# Altium project PW-Sat2_EPS_EM_MPPT-Buck-Boost-Conv.PrjPcb
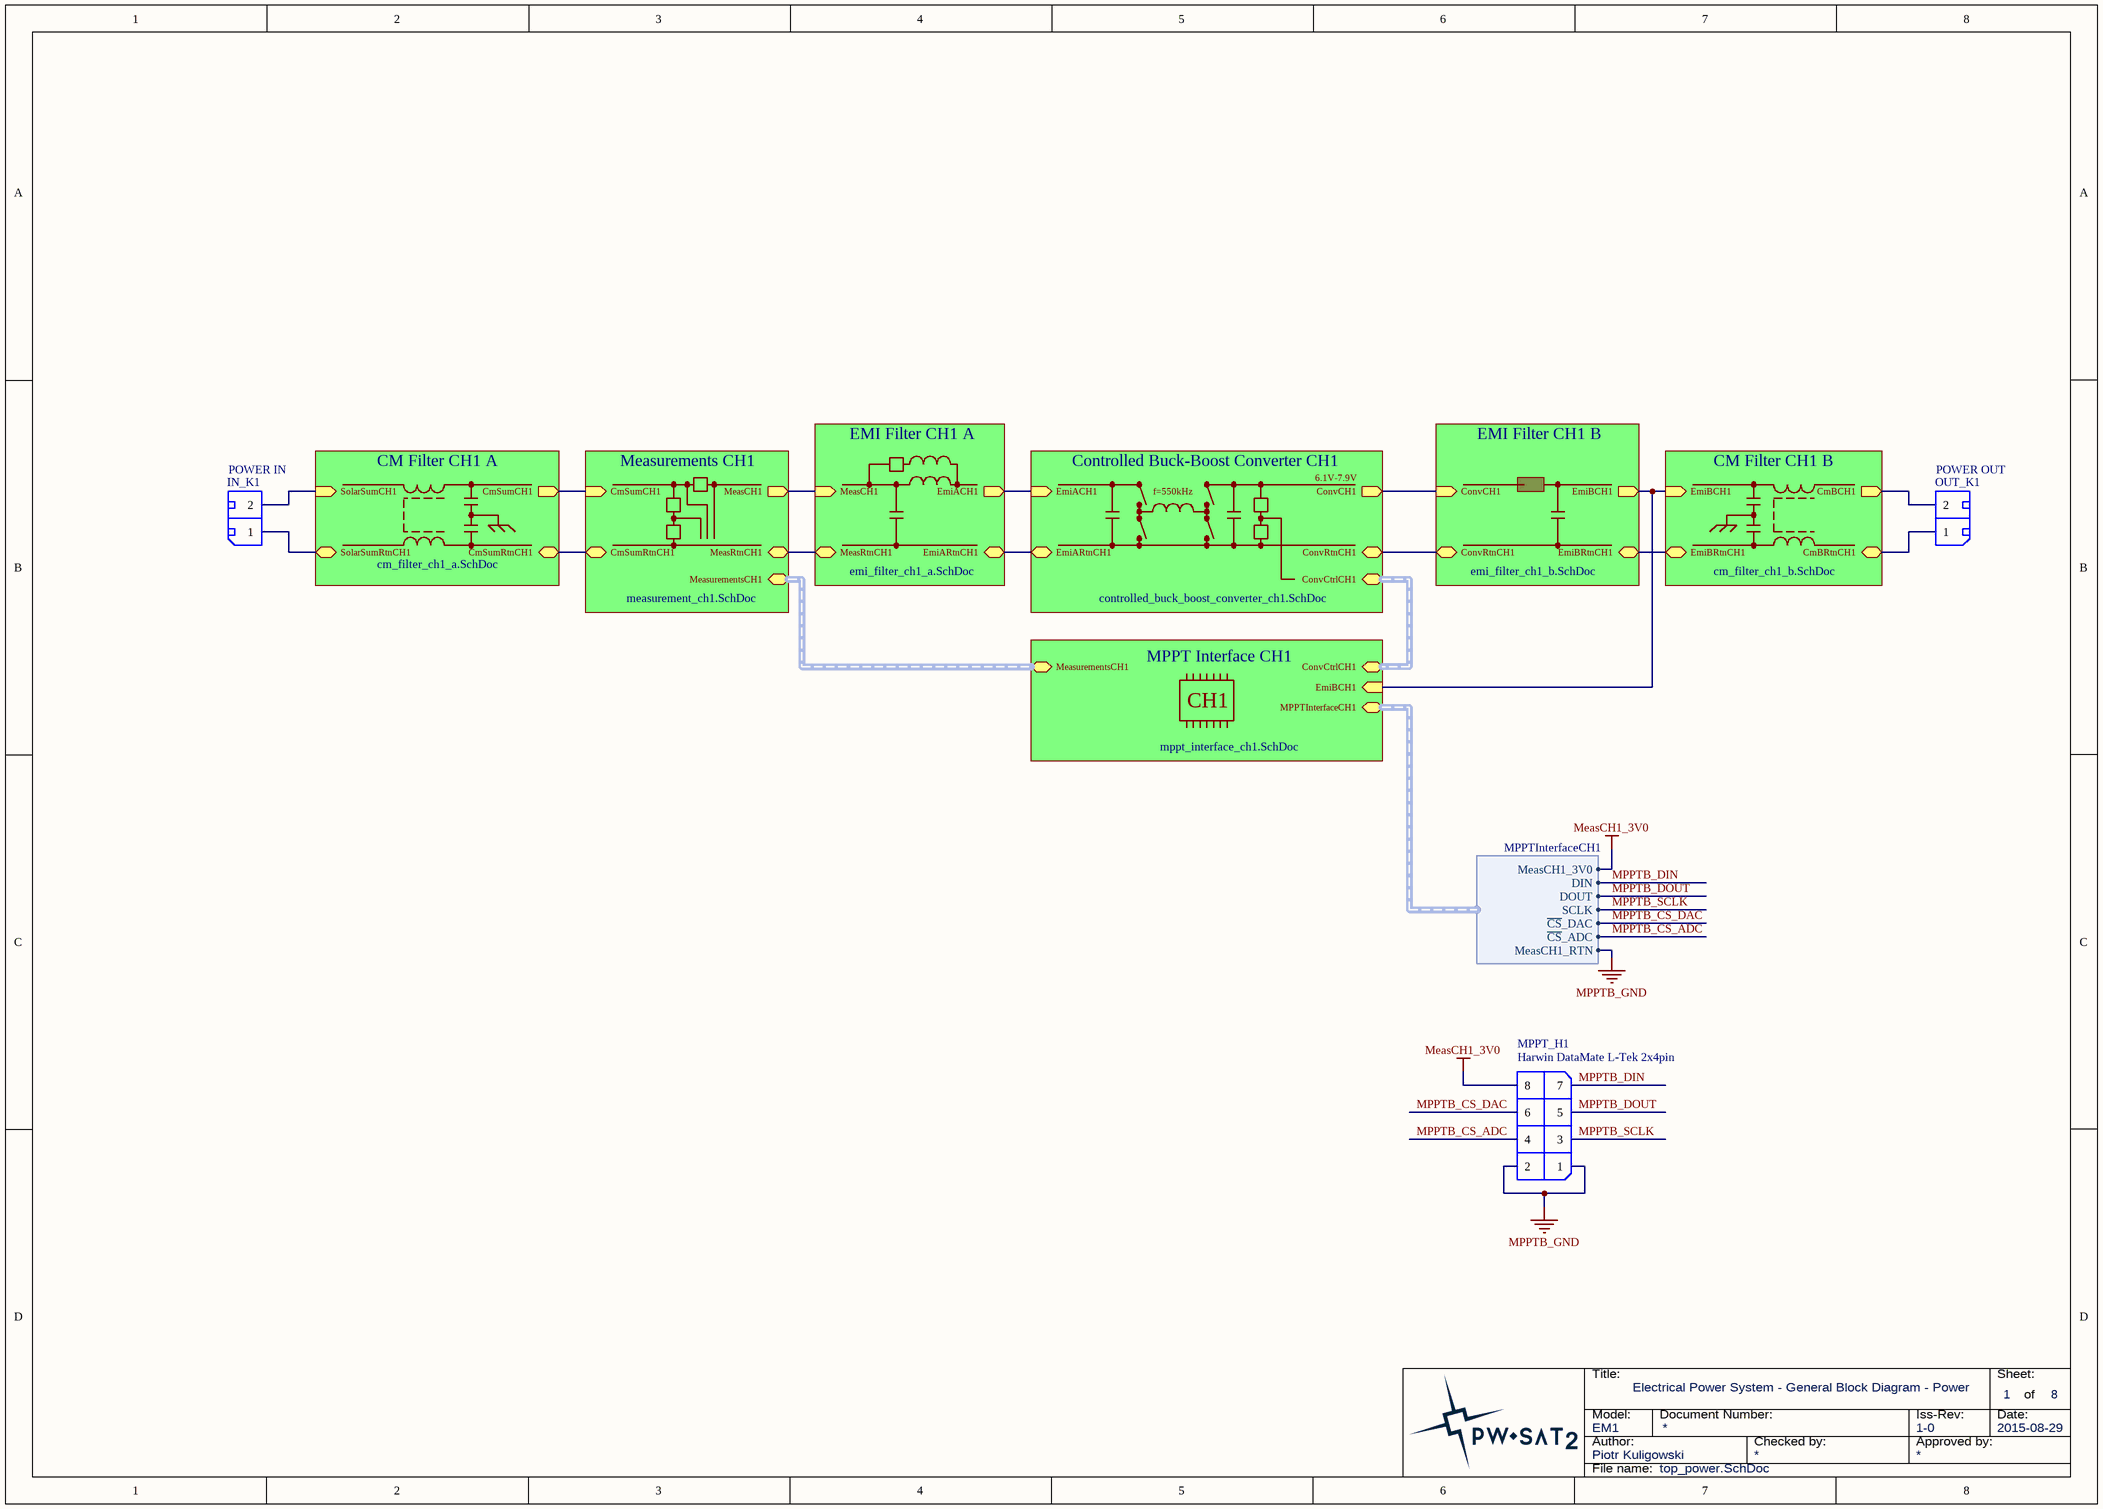
[diagram p0: top_power.SchDoc]
8 sheets, 80 parts. Net scope: hierarchical (ports join the sheet entries above them; power ports are global).
Sheets:
  top_power.SchDoc
    CM Filter CH1 A = cm_filter_ch1_a.SchDoc
    MPPT Interface CH1 = mppt_interface_ch1.SchDoc
    Measurements CH1 = measurement_ch1.SchDoc
    EMI Filter CH1 A = emi_filter_ch1_a.SchDoc
    EMI Filter CH1 B = emi_filter_ch1_b.SchDoc
    CM Filter CH1 B = cm_filter_ch1_b.SchDoc
    Controlled Buck-Boost Converter CH1 = controlled_buck_boost_converter_ch1.SchDoc

## Sheet top_power.SchDoc: Electrical Power System - General Block Diagram - Power
size A3; Date: 2015-08-29; Author: Piotr Kuligowski; Revision: 1-0; SheetNumber: 1; SheetTotal: 8; Model: EM1; PageSetup: Record=PageOptions|CenterHorizontal=True|CenterVertical=True|PrintScale=0.52|XCorrection=1.00|YCorrection=1.00|PrintKind=1|BorderSize=5000000|LeftOffset=0|BottomOffset=0|Orientation=2|PaperLength=4200|PaperWidth=2970|Scale=100|PaperSource=7|PrintQuality=600|MediaType=1|DitherType=10|PaperKind=A3|PrintScaleMode=1

### Parts
IN_K1  ProviderPartNumber: POWER IN  [TerminalBlock_Spring_2.54_2-R]  (hidden comment: TB-2.5-PD-xx)
MPPT_H1  Harwin DataMate L-Tek 2x4pin  [Harwin_Datamate_L-Tek_M80-8670805]
OUT_K1  ProviderPartNumber: POWER OUT  [TerminalBlock_Spring_2.54_2-R]  (hidden comment: TB-2.5-PD-xx)

### Sub-sheets
CM Filter CH1 A = cm_filter_ch1_a.SchDoc: CmSumCH1 (out), SolarSumCH1 (in), SolarSumRtnCH1, CmSumRtnCH1
CM Filter CH1 B = cm_filter_ch1_b.SchDoc: CmBCH1 (out), EmiBCH1 (in), EmiBRtnCH1, CmBRtnCH1
Controlled Buck-Boost Converter CH1 = controlled_buck_boost_converter_ch1.SchDoc: ConvCH1 (out), ConvRtnCH1, EmiACH1 (in), EmiARtnCH1, ConvCtrlCH1 (harness ConvCtrlCH1)
EMI Filter CH1 A = emi_filter_ch1_a.SchDoc: EmiACH1 (out), MeasCH1 (in), MeasRtnCH1, EmiARtnCH1
EMI Filter CH1 B = emi_filter_ch1_b.SchDoc: EmiBCH1 (out), ConvCH1 (in), ConvRtnCH1, EmiBRtnCH1
Measurements CH1 = measurement_ch1.SchDoc: MeasCH1 (out), CmSumCH1 (in), MeasRtnCH1, CmSumRtnCH1, MeasurementsCH1 (harness MeasurementsCH1)
MPPT Interface CH1 = mppt_interface_ch1.SchDoc: MPPTInterfaceCH1 (harness MPPTInterfaceCH1), EmiBCH1 (in), MeasurementsCH1 (harness MeasurementsCH1), ConvCtrlCH1 (harness ConvCtrlCH1)

### Harnesses
MPPTInterfaceCH1: DIN, DOUT, SCLK, ~{CS}_DAC, ~{CS}_ADC, MeasCH1_3V0, MeasCH1_RTN

### Nets
MeasCH1_3V0: MPPT_H1.8 ; sheet MPPT Interface CH1/MPPTInterfaceCH1.MeasCH1_3V0
MPPTB_GND: MPPT_H1.1 MPPT_H1.2 ; sheet CM Filter CH1 A/CmSumRtnCH1, sheet Measurements CH1/MeasRtnCH1, sheet Measurements CH1/CmSumRtnCH1, sheet EMI Filter CH1 A/MeasRtnCH1, sheet EMI Filter CH1 A/EmiARtnCH1, sheet EMI Filter CH1 B/ConvRtnCH1, sheet EMI Filter CH1 B/EmiBRtnCH1, sheet CM Filter CH1 B/EmiBRtnCH1, sheet Controlled Buck-Boost Converter CH1/ConvRtnCH1, sheet Controlled Buck-Boost Converter CH1/EmiARtnCH1, sheet MPPT Interface CH1/MPPTInterfaceCH1.MeasCH1_RTN  [project net DCDCB_GND]
MPPTB_CS_ADC: MPPT_H1.4 ; sheet MPPT Interface CH1/MPPTInterfaceCH1.~{CS}_ADC
MPPTB_CS_DAC: MPPT_H1.6 ; sheet MPPT Interface CH1/MPPTInterfaceCH1.~{CS}_DAC
MPPTB_DIN: MPPT_H1.7 ; sheet MPPT Interface CH1/MPPTInterfaceCH1.DIN
MPPTB_DOUT: MPPT_H1.5 ; sheet MPPT Interface CH1/MPPTInterfaceCH1.DOUT
MPPTB_SCLK: MPPT_H1.3 ; sheet MPPT Interface CH1/MPPTInterfaceCH1.SCLK
NetCMBA_C1_1: sheet CM Filter CH1 A/CmSumCH1, sheet Measurements CH1/CmSumCH1
NetCMBA_T1_1: IN_K1.2 ; sheet CM Filter CH1 A/SolarSumCH1
NetCMBA_T1_2: IN_K1.1 ; sheet CM Filter CH1 A/SolarSumRtnCH1
NetCMBB_C1_1: sheet MPPT Interface CH1/EmiBCH1, sheet EMI Filter CH1 B/EmiBCH1, sheet CM Filter CH1 B/EmiBCH1
NetCMBB_T1_3: OUT_K1.1 ; sheet CM Filter CH1 B/CmBRtnCH1
NetCMBB_T1_4: OUT_K1.2 ; sheet CM Filter CH1 B/CmBCH1
NetDCDCB_C3_2: sheet EMI Filter CH1 A/EmiACH1, sheet Controlled Buck-Boost Converter CH1/EmiACH1
NetDCDCB_C4_2: sheet EMI Filter CH1 B/ConvCH1, sheet Controlled Buck-Boost Converter CH1/ConvCH1
NetEMIBA_C1_1: sheet Measurements CH1/MeasCH1, sheet EMI Filter CH1 A/MeasCH1

### Buses and harness runs
harness sheet Controlled Buck-Boost Converter CH1/ConvCtrlCH1 = sheet MPPT Interface CH1/ConvCtrlCH1
harness sheet Measurements CH1/MeasurementsCH1 = sheet MPPT Interface CH1/MeasurementsCH1

### Notes on the sheet
- f=550kHz
- 6.1V-7.9V
- CH1
- Title:
- Sheet:
- of
- Author:
- Model:
- Document Number:
- Checked by:
- Iss-Rev:
- Approved by:
- Date:
- File name:

### Library data of the parts
IN_K1 OUT_K1 = TerminalBlock_Spring_2.54_2-R: Terminal block with spring, 2-pin, 2.54mm pitch, right angle.; Provider: TME.eu; Value: TB-2.5-PD-xx
MPPT_H1 = Harwin_Datamate_L-Tek_2x4pin: Harwin DataMate L-Tek, 2mm pitch, 2x4pin.; Value: Harwin DataMate L-Tek 2x4pin

## Sheet cm_filter_ch1_a.SchDoc: Common Mode Filter CH1 A
size A4; Date: 2015-02-21; Author: Piotr Kuligowski; Revision: 1-0; SheetTotal: 14; Model: EM1
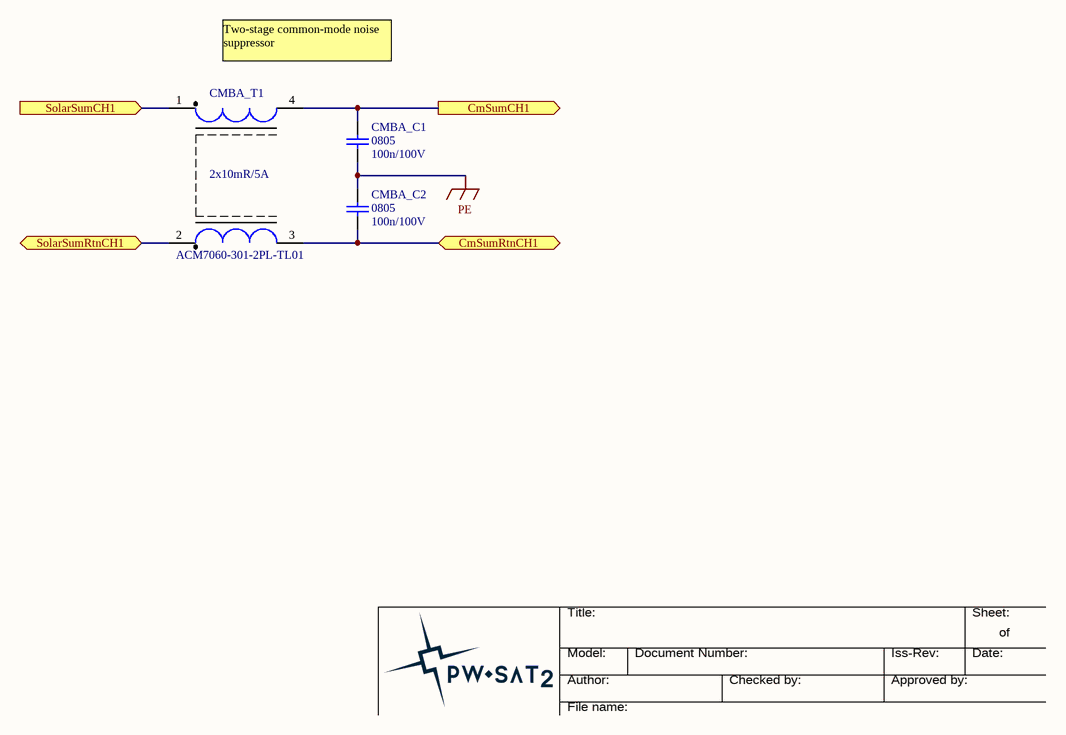
[diagram p1: cm_filter_ch1_a.SchDoc]

### Parts
CMBA_C1  Package: 0805  [SMD_Capacitor_0805]  (hidden comment: 100n/100V)
CMBA_C2  Package: 0805  [SMD_Capacitor_0805]  (hidden comment: 100n/100V)
CMBA_T1  2x10mR/5A  [TDK_ACM7060]

### Ports
CmSumCH1 (out), CmSumRtnCH1, SolarSumCH1 (in), SolarSumRtnCH1

### Nets
DCDCB_GND: CMBA_C2.2 CMBA_T1.3 ; port CmSumRtnCH1
PE: CMBA_C1.2 CMBA_C2.1
NetCMBA_C1_1: CMBA_C1.1 CMBA_T1.4 ; port CmSumCH1
NetCMBA_T1_1: CMBA_T1.1 ; port SolarSumCH1
NetCMBA_T1_2: CMBA_T1.2 ; port SolarSumRtnCH1

### Notes on the sheet
- Two-stage common-mode noise suppressor
- Title:
- Sheet:
- of
- Author:
- Model:
- Document Number:
- Checked by:
- Iss-Rev:
- Approved by:
- Date:
- File name:

### Library data of the parts
CMBA_C1 CMBA_C2 = Cer_C0805T104K1RCLTU: Ceramic Cap Kemet COTS 100n/100V X7R 0805; ManufacturerPartNumber: C0805T104K1RCLTU; Manufacturer: Kemet; Value: 100n/100V
CMBA_T1 = ACM7060-301-2PL-TL01: TDK ACM7060-301 Common Mode Choke; Manufacturer: TDK; ManufacturerPartNumber: ACM7060-301-2PL-TL01; Value: 2x10mR/5A

## Sheet mppt_interface_ch1.SchDoc: MPPT Interface CH1
size A3; Date: 2015-10-14; Author: Piotr Kuligowski; Revision: 1-0; SheetNumber: 8; SheetTotal: 8; Model: EM1
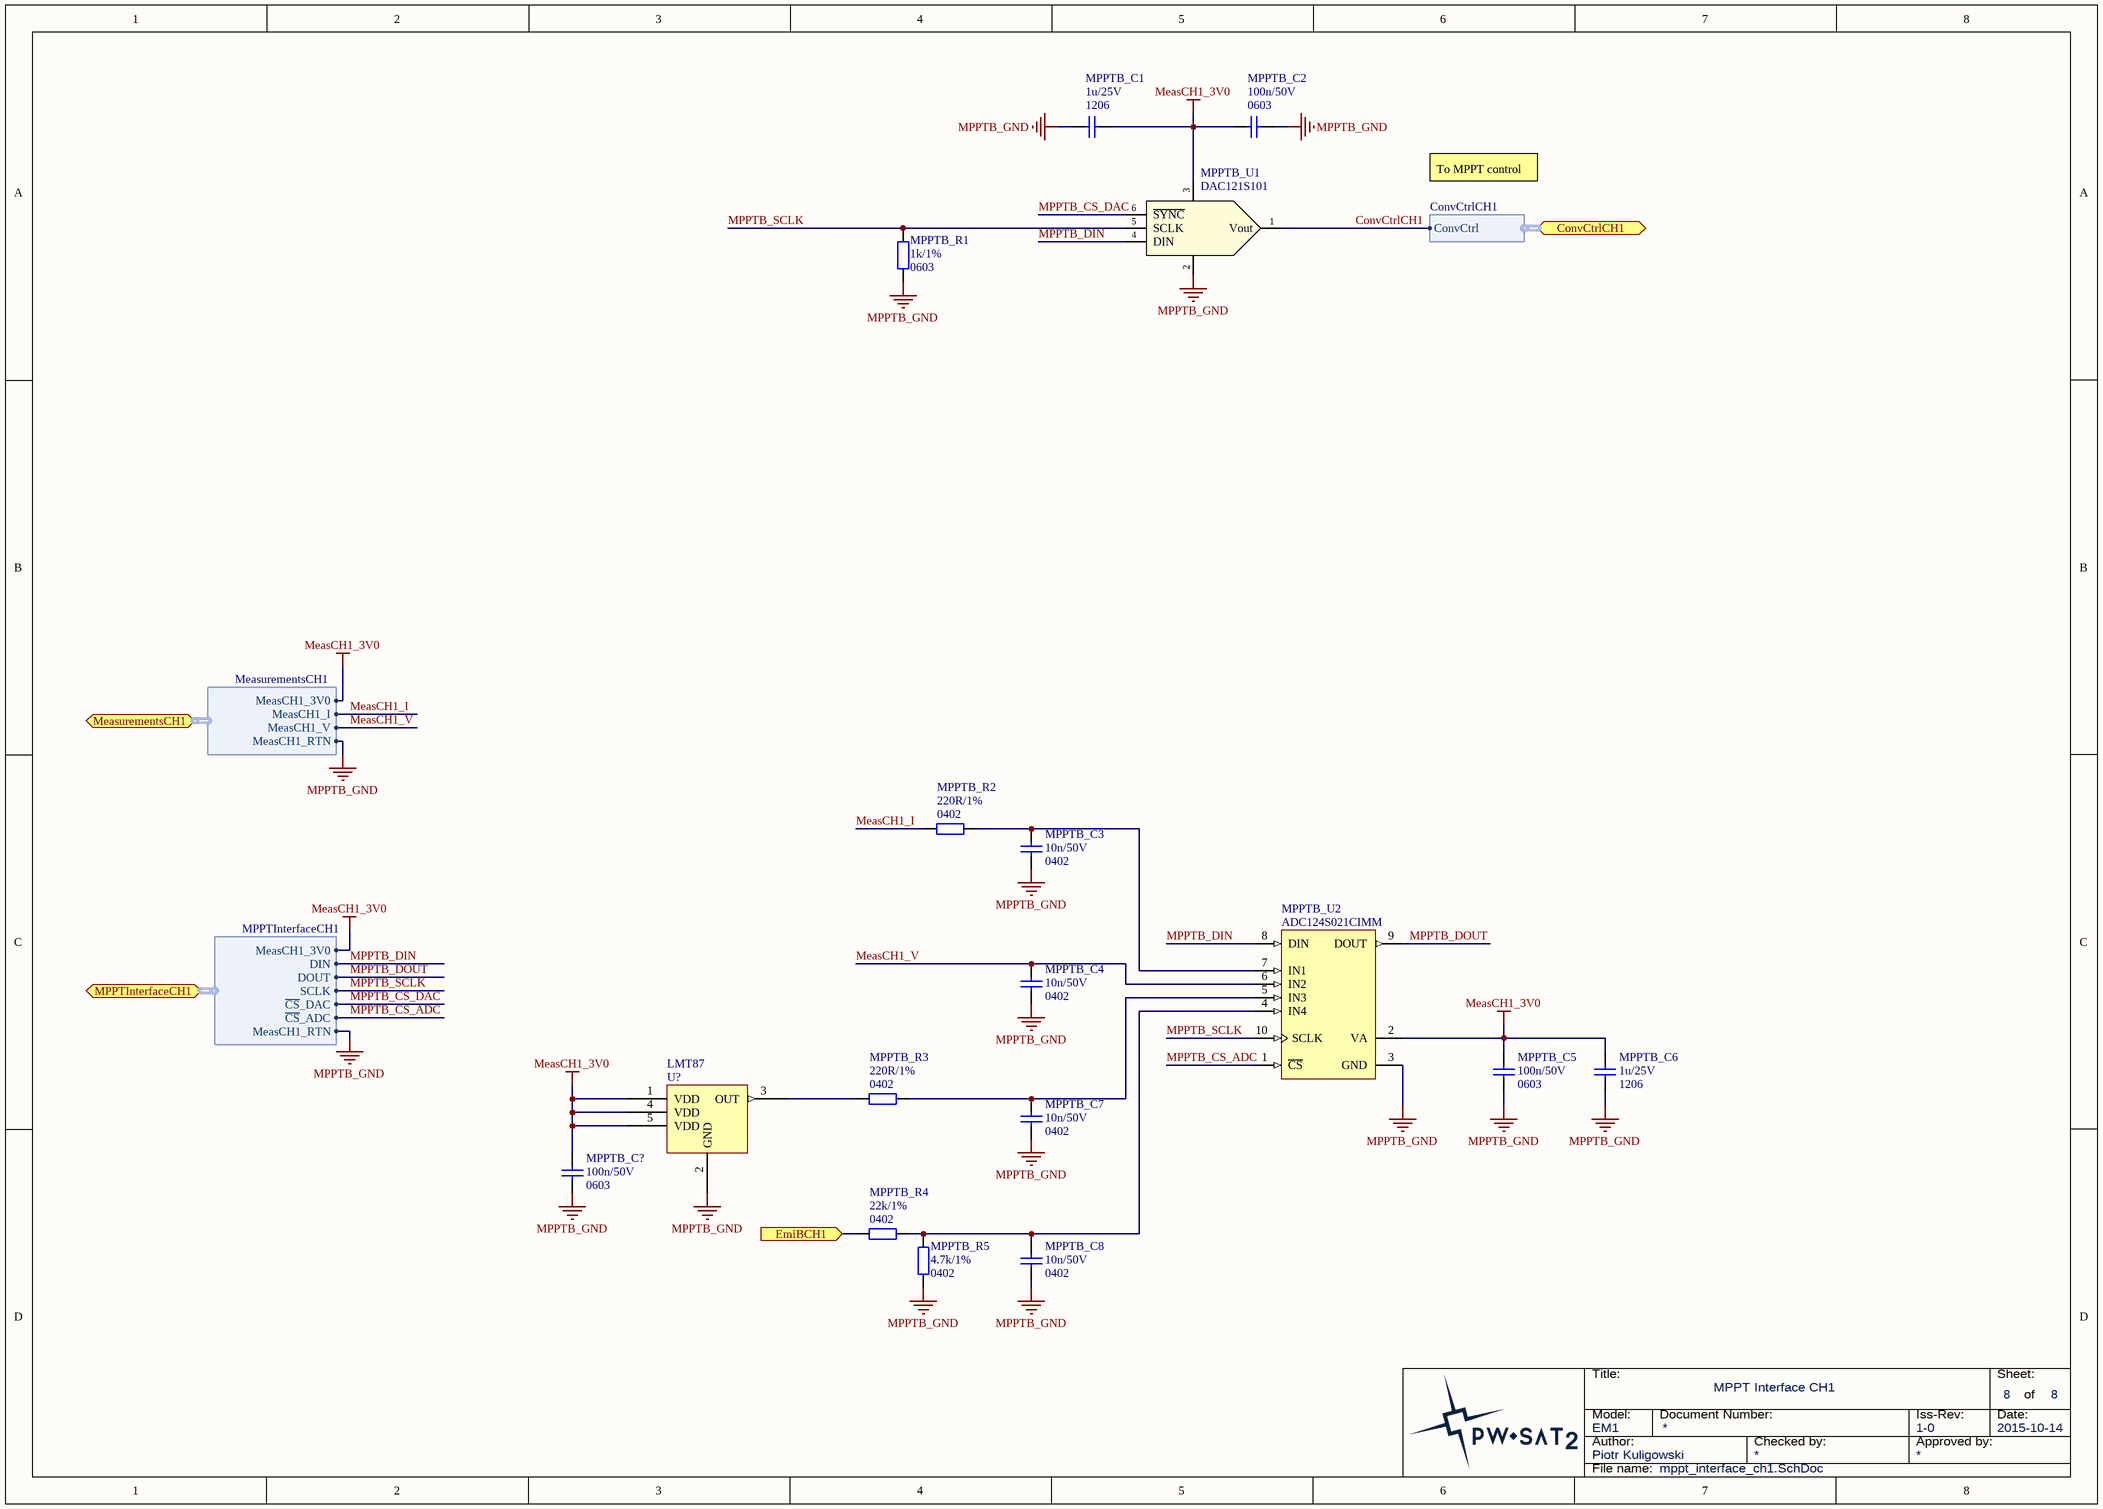
[diagram p2: mppt_interface_ch1.SchDoc]

### Parts
MPPTB_C1  Package: 1206  [SMD_Capacitor_1206]  (hidden comment: 1u/25V)
MPPTB_C2  Package: 0603  [SMD_Capacitor_0603]  (hidden comment: 100n/50V)
MPPTB_C3  Package: 0402  [SMD_Capacitor_0402]  (hidden comment: 10n/50V)
MPPTB_C4  Package: 0402  [SMD_Capacitor_0402]  (hidden comment: 10n/50V)
MPPTB_C5  Package: 0603  [SMD_Capacitor_0603]  (hidden comment: 100n/50V)
MPPTB_C6  Package: 1206  [SMD_Capacitor_1206]  (hidden comment: 1u/25V)
MPPTB_C7  Package: 0402  [SMD_Capacitor_0402]  (hidden comment: 10n/50V)
MPPTB_C8  Package: 0402  [SMD_Capacitor_0402]  (hidden comment: 10n/50V)
MPPTB_C?  Package: 0603  [SMD_Capacitor_0603]  (hidden comment: 100n/50V)
MPPTB_R1  Package: 0603  [SMD_Resistor_0603]  (hidden comment: 1k/1%)
MPPTB_R2  Package: 0402  [SMD_Resistor_0402]  (hidden comment: 220R/1%)
MPPTB_R3  Package: 0402  [SMD_Resistor_0402]  (hidden comment: 220R/1%)
MPPTB_R4  Package: 0402  [SMD_Resistor_0402]  (hidden comment: 22k/1%)
MPPTB_R5  Package: 0402  [SMD_Resistor_0402]  (hidden comment: 4.7k/1%)
MPPTB_U1  DAC121S101  [SOT23-6]
MPPTB_U2  ADC124S021CIMM  [MUB10A_L]
U?  LMT87  [SC70-LT5_N]

### Ports
ConvCtrlCH1 (harness ConvCtrlCH1), EmiBCH1 (in), MeasurementsCH1 (harness MeasurementsCH1), MPPTInterfaceCH1 (harness MPPTInterfaceCH1)

### Harnesses
MeasurementsCH1: MeasCH1_RTN, MeasCH1_V, MeasCH1_I, MeasCH1_3V0
ConvCtrlCH1: ConvCtrl
MPPTInterfaceCH1: DIN, DOUT, SCLK, ~{CS}_DAC, ~{CS}_ADC, MeasCH1_3V0, MeasCH1_RTN

### Nets
MeasCH1_3V0: MPPTB_C1.2 MPPTB_C2.2 MPPTB_C5.1 MPPTB_C6.1 MPPTB_C?.1 MPPTB_U1.3(Va) MPPTB_U2.2(VA) U?.1(VDD) U?.4(VDD) U?.5(VDD) ; port MeasurementsCH1.MeasCH1_3V0, port MPPTInterfaceCH1.MeasCH1_3V0
MPPTB_GND: MPPTB_C1.1 MPPTB_C2.1 MPPTB_C3.2 MPPTB_C4.2 MPPTB_C5.2 MPPTB_C6.2 MPPTB_C7.2 MPPTB_C8.2 MPPTB_C?.2 MPPTB_R1.2 MPPTB_R5.2 MPPTB_U1.2(GND) MPPTB_U2.3(GND) U?.2(GND) ; port MeasurementsCH1.MeasCH1_RTN, port MPPTInterfaceCH1.MeasCH1_RTN  [project net DCDCB_GND]
ConvCtrlCH1: MPPTB_U1.1(Vout) ; port ConvCtrlCH1.ConvCtrl
MeasCH1_I: MPPTB_R2.1 ; port MeasurementsCH1.MeasCH1_I
MeasCH1_V: MPPTB_C4.1 MPPTB_U2.6(IN2) ; port MeasurementsCH1.MeasCH1_V
MPPTB_CS_ADC: MPPTB_U2.1(~{CS}) ; port MPPTInterfaceCH1.~{CS}_ADC
MPPTB_CS_DAC: MPPTB_U1.6(~{SYNC}) ; port MPPTInterfaceCH1.~{CS}_DAC
MPPTB_DIN: MPPTB_U1.4(DIN) MPPTB_U2.8(DIN) ; port MPPTInterfaceCH1.DIN
MPPTB_DOUT: MPPTB_U2.9(DOUT) ; port MPPTInterfaceCH1.DOUT
MPPTB_SCLK: MPPTB_R1.1 MPPTB_U1.5(SCLK) MPPTB_U2.10(SCLK) ; port MPPTInterfaceCH1.SCLK
NetCMBB_C1_1: MPPTB_R4.1 ; port EmiBCH1
NetMPPTB_C3_1: MPPTB_C3.1 MPPTB_R2.2 MPPTB_U2.7(IN1)
NetMPPTB_C7_1: MPPTB_C7.1 MPPTB_R3.2 MPPTB_U2.5(IN3)
NetMPPTB_C8_1: MPPTB_C8.1 MPPTB_R4.2 MPPTB_R5.1 MPPTB_U2.4(IN4)
NetMPPTB_R3_1: MPPTB_R3.1 U?.3(OUT)

### Notes on the sheet
- To MPPT control
- Title:
- Sheet:
- of
- Author:
- Model:
- Document Number:
- Checked by:
- Iss-Rev:
- Approved by:
- Date:
- File name:

### Library data of the parts
MPPTB_C1 MPPTB_C6 = Cer_C1206T105K3RALTU: Ceramic Cap Kemet COTS 1u/25V X7R 1206; ManufacturerPartNumber: C1206T105K3RALTU; Manufacturer: Kemet; Value: 1u/25V
MPPTB_C2 MPPTB_C5 MPPTB_C? = Cer_C0603T104K5RALTU: Ceramic Cap Kemet COTS 100n/50V X7R 0603; Manufacturer: Kemet; ManufacturerPartNumber: C0603T104K5RALTU; Value: 100n/50V
MPPTB_C3 MPPTB_C4 MPPTB_C7 MPPTB_C8 = Cer_C0402T103K5RALTU: Ceramic Cap Kemet COTS 10n/50V X7R 0402; ManufacturerPartNumber: C0402T103K5RALTU; Manufacturer: Kemet; Value: 10n/50V
MPPTB_R1 = CRCW06031K00FKxxxx: 1k/1% Vishay CRCW 0603 Resistor. 100mW, 100ppm, 75V.; Manufacturer: Vishay; ManufacturerPartNumber: CRCW06031K00FKxxxx; Value: 1k/1%
MPPTB_R2 MPPTB_R3 = CRCW0402220RFKxxxx: 220R/1% Vishay CRCW 0402 Resistor. 63mW, 100ppm, 50V.; Manufacturer: Vishay; ManufacturerPartNumber: CRCW0402220RFKxxxx; Value: 220R/1%
MPPTB_R4 = CRCW040222K0FKxxxx: 22k/1% Vishay CRCW 0402 Resistor. 63mW, 100ppm, 50V.; Manufacturer: Vishay; ManufacturerPartNumber: CRCW040222K0FKxxxx; Value: 22k/1%
MPPTB_R5 = CRCW04024K70FKxxxx: 4.7k/1% Vishay CRCW 0402 Resistor. 63mW, 100ppm, 50V.; ManufacturerPartNumber: CRCW04024K70FKxxxx; Manufacturer: Vishay; Value: 4.7k/1%
MPPTB_U1 = DAC121S101: 12-Bit Micro Power, RRO Digital-to-Analog Converter.; Manufacturer: Texas Instruments; Value: DAC121S101
MPPTB_U2 = ADC124S021CIMM/NOPB: Manufacturer: Texas Instruments; ManufacturerPartNumber: ADC124S021CIMM/NOPB; Value: ADC124S021CIMM
U? = LMT87: Analog Temperature Sensors with Class-AB Output

## Sheet measurement_ch1.SchDoc: Measurements CH1
size A4; Date: 2015-02-22; Author: Piotr Kuligowski; Revision: 1-0; SheetTotal: 14; Model: EM1
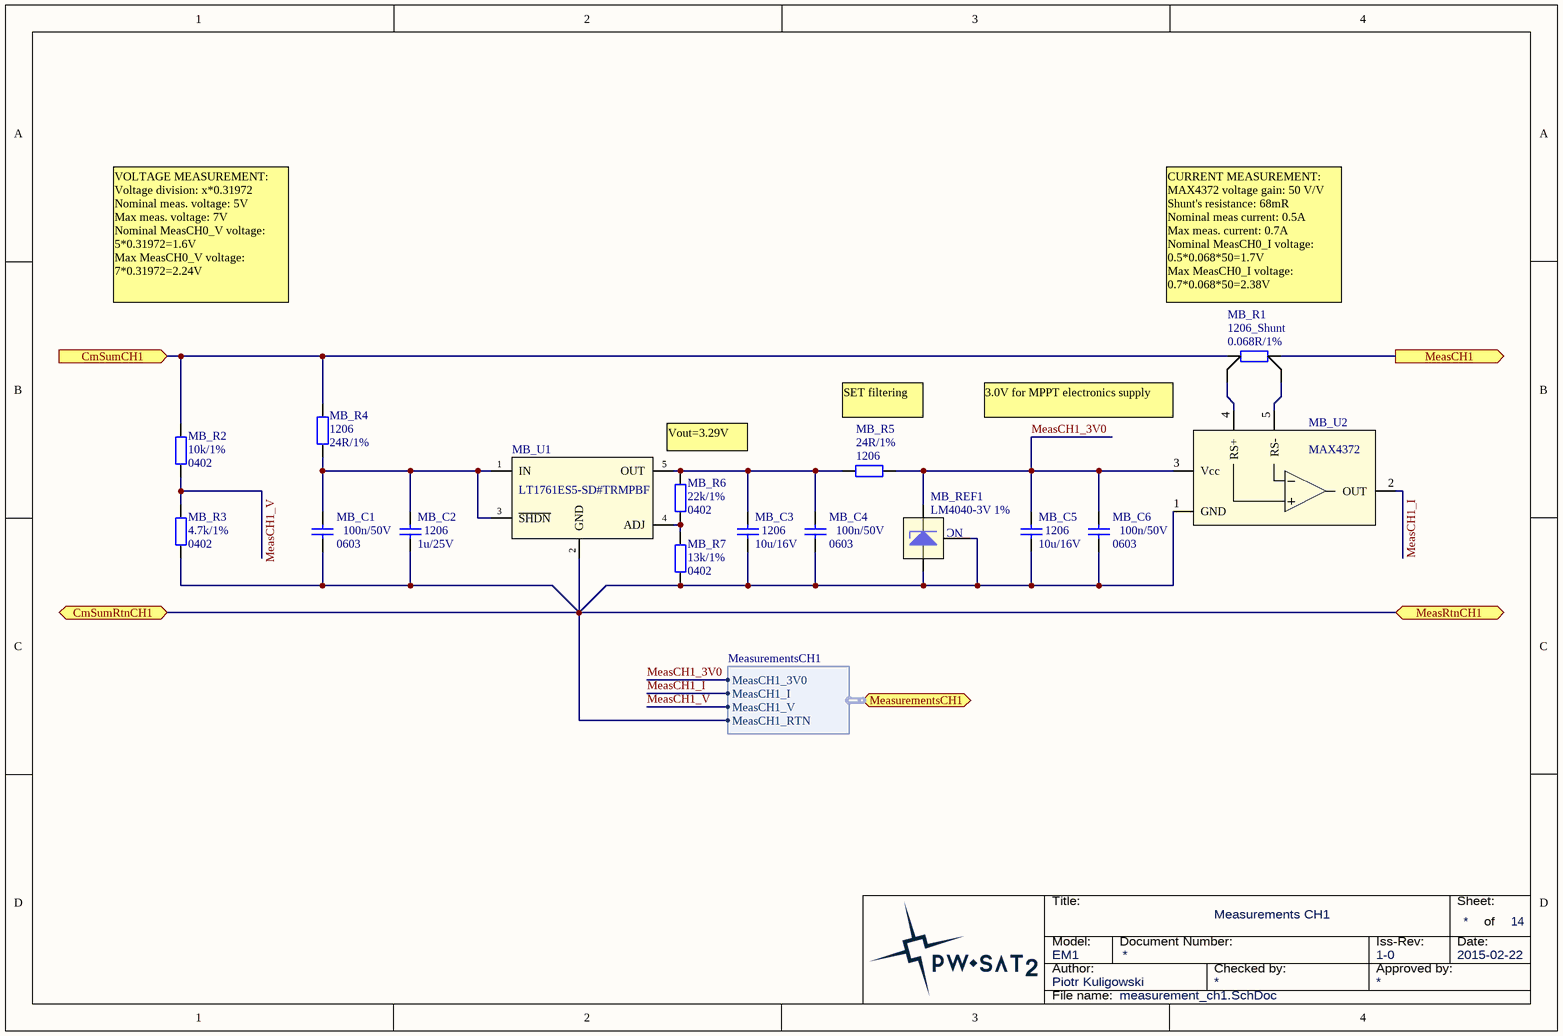
[diagram p3: measurement_ch1.SchDoc]

### Parts
MB_C1  Package: 0603  [SMD_Capacitor_0603]  (hidden comment: 100n/50V)
MB_C2  Package: 1206  [SMD_Capacitor_1206]  (hidden comment: 1u/25V)
MB_C3  Packge: 1206  [SMD_Capacitor_1206]  (hidden comment: 10u/16V)
MB_C4  Package: 0603  [SMD_Capacitor_0603]  (hidden comment: 100n/50V)
MB_C5  Packge: 1206  [SMD_Capacitor_1206]  (hidden comment: 10u/16V)
MB_C6  Package: 0603  [SMD_Capacitor_0603]  (hidden comment: 100n/50V)
MB_R1  Package: 1206_Shunt  [SMD_Resistor-Shunt_1206]  (hidden comment: 0.068R/1%)
MB_R2  Package: 0402  [SMD_Resistor_0402]  (hidden comment: 10k/1%)
MB_R3  Package: 0402  [SMD_Resistor_0402]  (hidden comment: 4.7k/1%)
MB_R4  Package: 1206  [SMD_Resistor_1206]  (hidden comment: 24R/1%)
MB_R5  Package: 1206  [SMD_Resistor_1206]  (hidden comment: 24R/1%)
MB_R6  Package: 0402  [SMD_Resistor_0402]  (hidden comment: 22k/1%)
MB_R7  Package: 0402  [SMD_Resistor_0402]  (hidden comment: 13k/1%)
MB_REF1  LM4040-3V 1%  [SOT23-3]
MB_U1  LT1761ES5-SD#TRMPBF  [SOT23-5]
MB_U2  MAX4372  [SOT23-5]

### Ports
CmSumCH1 (in), CmSumRtnCH1, MeasCH1 (out), MeasRtnCH1, MeasurementsCH1 (harness MeasurementsCH1)

### Harnesses
MeasurementsCH1: MeasCH1_RTN, MeasCH1_V, MeasCH1_I, MeasCH1_3V0

### Nets
DCDCB_GND: MB_C1.2 MB_C2.2 MB_C3.2 MB_C4.2 MB_C5.2 MB_C6.2 MB_R3.2 MB_R7.2 MB_REF1.2(A) MB_REF1.3(NC) MB_U1.2(GND) MB_U2.1(GND) ; port MeasRtnCH1, port CmSumRtnCH1, port MeasurementsCH1.MeasCH1_RTN
MeasCH1_3V0: MB_C5.1 MB_C6.1 MB_R5.2 MB_REF1.1(K) MB_U2.3(Vcc) ; port MeasurementsCH1.MeasCH1_3V0
MeasCH1_I: MB_U2.2(OUT) ; port MeasurementsCH1.MeasCH1_I
MeasCH1_V: MB_R2.2 MB_R3.1 ; port MeasurementsCH1.MeasCH1_V
NetCMBA_C1_1: MB_R1.1 MB_R2.1 MB_R4.1 ; port CmSumCH1
NetEMIBA_C1_1: MB_R1.4 ; port MeasCH1
NetMB_C1_1: MB_C1.1 MB_C2.1 MB_R4.2 MB_U1.1(IN) MB_U1.3(~{SHDN})
NetMB_C3_1: MB_C3.1 MB_C4.1 MB_R5.1 MB_R6.1 MB_U1.5(OUT)
NetMB_R1_2: MB_R1.2 MB_U2.4(RS+)
NetMB_R1_3: MB_R1.3 MB_U2.5(RS-)
NetMB_R6_2: MB_R6.2 MB_R7.1 MB_U1.4(ADJ)

### Notes on the sheet
- VOLTAGE MEASUREMENT:
  Voltage division: x*0.31972
  Nominal meas. voltage: 5V
  Max meas. voltage: 7V
  Nominal MeasCH0_V voltage: 5*0.31972=1.6V
  Max MeasCH0_V voltage: 7*0.31972=2.24V
- CURRENT MEASUREMENT:
  MAX4372 voltage gain: 50 V/V
  Shunt's resistance: 68mR
  Nominal meas current: 0.5A
  Max meas. current: 0.7A
  Nominal MeasCH0_I voltage: 0.5*0.068*50=1.7V
  Max MeasCH0_I voltage: 0.7*0.068*50=2.38V
- Vout=3.29V
- SET filtering
- (near MB_U2) 3.0V for MPPT electronics supply
- Title:
- Sheet:
- of
- Author:
- Model:
- Document Number:
- Checked by:
- Iss-Rev:
- Approved by:
- Date:
- File name:

### Library data of the parts
MB_C1 MB_C4 MB_C6 = Cer_GCJ188R71H104KA12D: Ceramic Cap Murata Automotive 100n/50V X7R 0603; Manufacturer: Murata; ManufacturerPartNumber: GCJ188R71H104KA12D; Value: 100n/50V
MB_C2 = Cer_C1206T105K3RALTU: Ceramic Cap Kemet COTS 1u/25V X7R 1206; ManufacturerPartNumber: C1206T105K3RALTU; Manufacturer: Kemet; Value: 1u/25V
MB_C3 MB_C5 = Cer_C1206T106K4RACTU: Ceramic Cap Kemet COTS 10u/16V X7R 1206; ManufacturerPartNumber: C1206T106K4RACTU; Manufacturer: Kemet; Value: 10u/16V
MB_R1 = ERJ-8BWFR068V: Panasonic Resistor 68mR 1% 1206 1W; Manufacturer: Panasonic; ManufacturerPartNumber: ERJ-8BWFR068V; Value: 0.068R/1%
MB_R2 = CRCW040210K0FKxxxx: 10k/1% Vishay CRCW 0402 Resistor. 63mW, 100ppm, 50V.; Manufacturer: Vishay; ManufacturerPartNumber: CRCW040210K0FKxxxx; Value: 10k/1%
MB_R3 = CRCW04024K70FKxxxx: as MPPTB_R5 on sheet mppt_interface_ch1; ManufacturerPartNumber: CRCW04024K70FKxxxx; Manufacturer: Vishay; Value: 4.7k/1%
MB_R4 MB_R5 = CRCW120624R0FKxxxx: 24R/1% Vishay CRCW 1206 Resistor. 250mW, 100ppm, 200V.; ManufacturerPartNumber: CRCW120624R0FKxxxx; Manufacturer: Vishay; Value: 24R/1%
MB_R6 = CRCW040222K0FKxxxx: as MPPTB_R4 on sheet mppt_interface_ch1; Manufacturer: Vishay; ManufacturerPartNumber: CRCW040222K0FKxxxx; Value: 22k/1%
MB_R7 = CRCW040213K0FKxxxx: 13k/1% Vishay CRCW 0402 Resistor. 63mW, 100ppm, 50V.; ManufacturerPartNumber: CRCW040213K0FKxxxx; Manufacturer: Vishay; Value: 13k/1%
MB_REF1 = LM4040DIM3-3.0: Shunt V-REF, 3V, 1%, SOT23-3; Manufacturer: Texas Instruments; ManufacturerPartNumber: LM4040DIM3-3.0; Value: LM4040-3V 1%
MB_U1 = LT1761ES5-SD#TRMPBF: 100mA, Regulated, Low Noise, LDO Micropower Regulator in TSOT-23; Manufacturer: Linear Technology; Value: LT1761ES5-SD#TRMPBF
MB_U2 = MAX4372: High-Side Current-Sense Amplifier with Voltage Output; Manufacturer: Maxim Integrated Products; Value: MAX4372

## Sheet emi_filter_ch1_a.SchDoc: EMI Filter CH1 A
size A4; Date: 2015-10-11; Author: Piotr Kuligowski; Revision: 1-0; SheetTotal: 14; Model: EM1
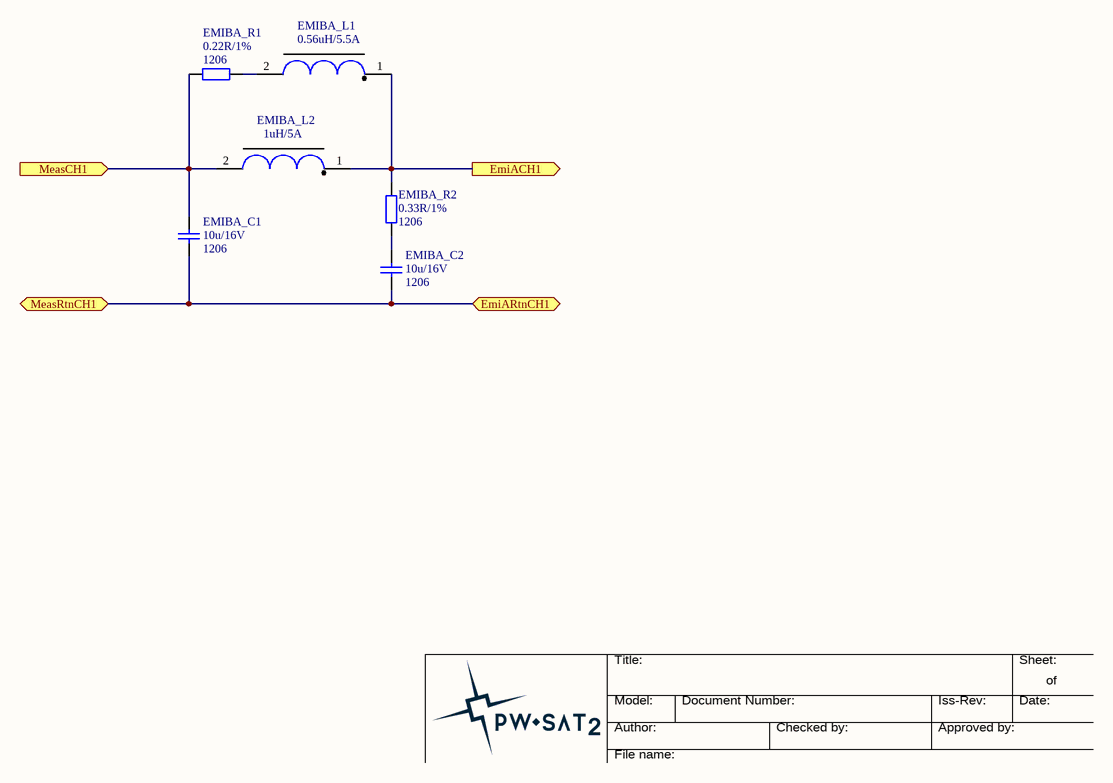
[diagram p4: emi_filter_ch1_a.SchDoc]

### Parts
EMIBA_C1  Packge: 1206  [SMD_Capacitor_1206]  (hidden comment: 10u/16V)
EMIBA_C2  Packge: 1206  [SMD_Capacitor_1206]  (hidden comment: 10u/16V)
EMIBA_L1  0.56uH/5.5A  [Vishay_IHLP1212]
EMIBA_L2  1uH/5A  [Vishay_IHLP1212]
EMIBA_R1  Package: 1206  [SMD_Resistor_1206]  (hidden comment: 0.22R/1%)
EMIBA_R2  Package: 1206  [SMD_Resistor_1206]  (hidden comment: 0.33R/1%)

### Ports
EmiACH1 (out), EmiARtnCH1, MeasCH1 (in), MeasRtnCH1

### Nets
DCDCB_GND: EMIBA_C1.2 EMIBA_C2.2 ; port MeasRtnCH1, port EmiARtnCH1
NetDCDCB_C3_2: EMIBA_L1.1 EMIBA_L2.1 EMIBA_R2.2 ; port EmiACH1
NetEMIBA_C1_1: EMIBA_C1.1 EMIBA_L2.2 EMIBA_R1.1 ; port MeasCH1
NetEMIBA_C2_1: EMIBA_C2.1 EMIBA_R2.1
NetEMIBA_L1_2: EMIBA_L1.2 EMIBA_R1.2

### Notes on the sheet
- Title:
- Sheet:
- of
- Author:
- Model:
- Document Number:
- Checked by:
- Iss-Rev:
- Approved by:
- Date:
- File name:

### Library data of the parts
EMIBA_C1 EMIBA_C2 = Cer_C1206T106K4RACTU: Ceramic Cap Kemet COTS 10u/16V X7R 1206; ManufacturerPartNumber: C1206T106K4RACTU; Manufacturer: Kemet; Value: 10u/16V
EMIBA_L1 = IHLP1212BZERR56M11: Vishay IHLP1212 Inductor, L=0.56uH, Irise40deg=5.5A, ESR=16mR, SRF=1MHz.; Manufacturer: Vishay; ManufacturerPartNumber: IHLP1212BZERR56M11; Value: 0.56uH/5.5A
EMIBA_L2 = IHLP1212BZER1R0M11: Vishay IHLP1212 Inductor, L=1uH, Irise40deg=5A, ESR=20mR, SRF=1MHz.; Manufacturer: Vishay; ManufacturerPartNumber: IHLP1212BZER1R0M11; Value: 1uH/5A
EMIBA_R1 = ERJ-8BQFR22V: Panasonic Resistor 0.22R 1% 1206 330mW; Manufacturer: Panasonic; ManufacturerPartNumber: ERJ-8BQFR22V; Value: 0.22R/1%
EMIBA_R2 = ERJ-8BQFR33V: Panasonic Resistor 0.33R 1% 1206 330mW; Manufacturer: Panasonic; ManufacturerPartNumber: ERJ-8BQFR33V; Value: 0.33R/1%

## Sheet emi_filter_ch1_b.SchDoc: EMI Filter CH1 B
size A4; Date: 2015-10-11; Author: Piotr Kuligowski; Revision: 1-0; SheetTotal: 14; Model: EM1
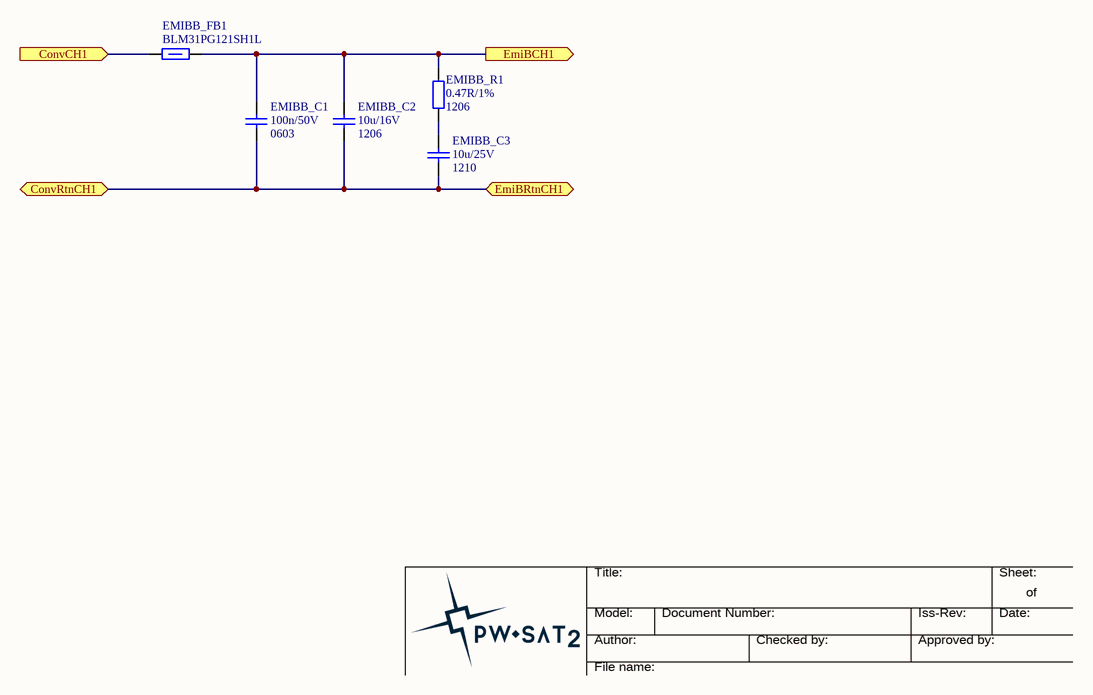
[diagram p5: emi_filter_ch1_b.SchDoc]

### Parts
EMIBB_C1  Package: 0603  [SMD_Capacitor_0603]  (hidden comment: 100n/50V)
EMIBB_C2  Packge: 1206  [SMD_Capacitor_1206]  (hidden comment: 10u/16V)
EMIBB_C3  Package: 1210  [SMD_Capacitor_1210]  (hidden comment: 10u/25V)
EMIBB_FB1  120R/100MHz  [SMD_FerriteBead_1206]  (value not drawn)
EMIBB_R1  Package: 1206  [SMD_Resistor_1206]  (hidden comment: 0.47R/1%)

### Ports
ConvCH1 (in), ConvRtnCH1, EmiBCH1 (out), EmiBRtnCH1

### Nets
DCDCB_GND: EMIBB_C1.2 EMIBB_C2.2 EMIBB_C3.2 ; port ConvRtnCH1, port EmiBRtnCH1
NetCMBB_C1_1: EMIBB_C1.1 EMIBB_C2.1 EMIBB_FB1.1 EMIBB_R1.2 ; port EmiBCH1
NetDCDCB_C4_2: EMIBB_FB1.2 ; port ConvCH1
NetEMIBB_C3_1: EMIBB_C3.1 EMIBB_R1.1

### Notes on the sheet
- Title:
- Sheet:
- of
- Author:
- Model:
- Document Number:
- Checked by:
- Iss-Rev:
- Approved by:
- Date:
- File name:

### Library data of the parts
EMIBB_C1 = Cer_C0603T104K5RALTU: Ceramic Cap Kemet COTS 100n/50V X7R 0603; Manufacturer: Kemet; ManufacturerPartNumber: C0603T104K5RALTU; Value: 100n/50V
EMIBB_C2 = Cer_C1206T106K4RACTU: Ceramic Cap Kemet COTS 10u/16V X7R 1206; ManufacturerPartNumber: C1206T106K4RACTU; Manufacturer: Kemet; Value: 10u/16V
EMIBB_C3 = Cer_GCJ32ER71E106KA12L: Ceramic Cap Murata Automotive 10u/25V X7R 1210; Manufacturer: Murata; ManufacturerPartNumber: GCJ32ER71E106KA12L; Value: 10u/25V
EMIBB_FB1 = BLM31PG121SH1L: Ferrite bead, 1206, 0.02HM, 3.5A.; Manufacturer: Murata; Current Rating: 3.5A; Series Resistance DC: 0.02R; Package: 1206; Value: 120R/100MHz; ManufacturerPartNumber: BLM31PG121SH1L
EMIBB_R1 = ERJ-8BQFR47V: Panasonic Resistor 0.47R 1% 1206 330mW; ManufacturerPartNumber: ERJ-8BQFR47V; Manufacturer: Panasonic; Value: 0.47R/1%

## Sheet cm_filter_ch1_b.SchDoc: Common Mode Filter CH1 B
size A4; Date: 2015-02-21; Author: Piotr Kuligowski; Revision: 1-0; SheetTotal: 14; Model: EM1
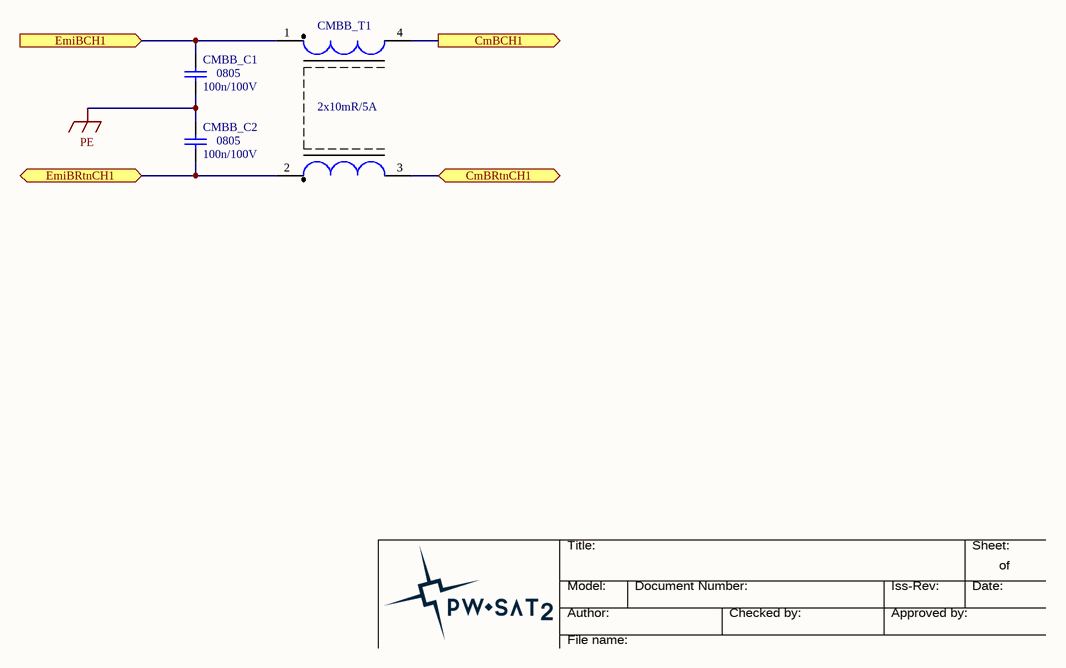
[diagram p6: cm_filter_ch1_b.SchDoc]

### Parts
CMBB_C1  Package: 0805  [SMD_Capacitor_0805]  (hidden comment: 100n/100V)
CMBB_C2  Package: 0805  [SMD_Capacitor_0805]  (hidden comment: 100n/100V)
CMBB_T1  2x10mR/5A  [TDK_ACM7060]

### Ports
CmBCH1 (out), CmBRtnCH1, EmiBCH1 (in), EmiBRtnCH1

### Nets
DCDCB_GND: CMBB_C2.2 CMBB_T1.2 ; port EmiBRtnCH1
PE: CMBB_C1.2 CMBB_C2.1
NetCMBB_C1_1: CMBB_C1.1 CMBB_T1.1 ; port EmiBCH1
NetCMBB_T1_3: CMBB_T1.3 ; port CmBRtnCH1
NetCMBB_T1_4: CMBB_T1.4 ; port CmBCH1

### Notes on the sheet
- Title:
- Sheet:
- of
- Author:
- Model:
- Document Number:
- Checked by:
- Iss-Rev:
- Approved by:
- Date:
- File name:

### Library data of the parts
CMBB_C1 CMBB_C2 = Cer_C0805T104K1RCLTU: as CMBA_C1 on sheet cm_filter_ch1_a; ManufacturerPartNumber: C0805T104K1RCLTU; Manufacturer: Kemet; Value: 100n/100V
CMBB_T1 = ACM7060-301-2PL-TL01: TDK ACM7060-301 Common Mode Choke; Manufacturer: TDK; ManufacturerPartNumber: ACM7060-301-2PL-TL01; Value: 2x10mR/5A

## Sheet controlled_buck_boost_converter_ch1.SchDoc: Controlled Buck-Boost Converter CH1
size A4; Date: 2016-01-06; Author: Piotr Kuligowski; Revision: 1-0; SheetTotal: 14; Model: EM1
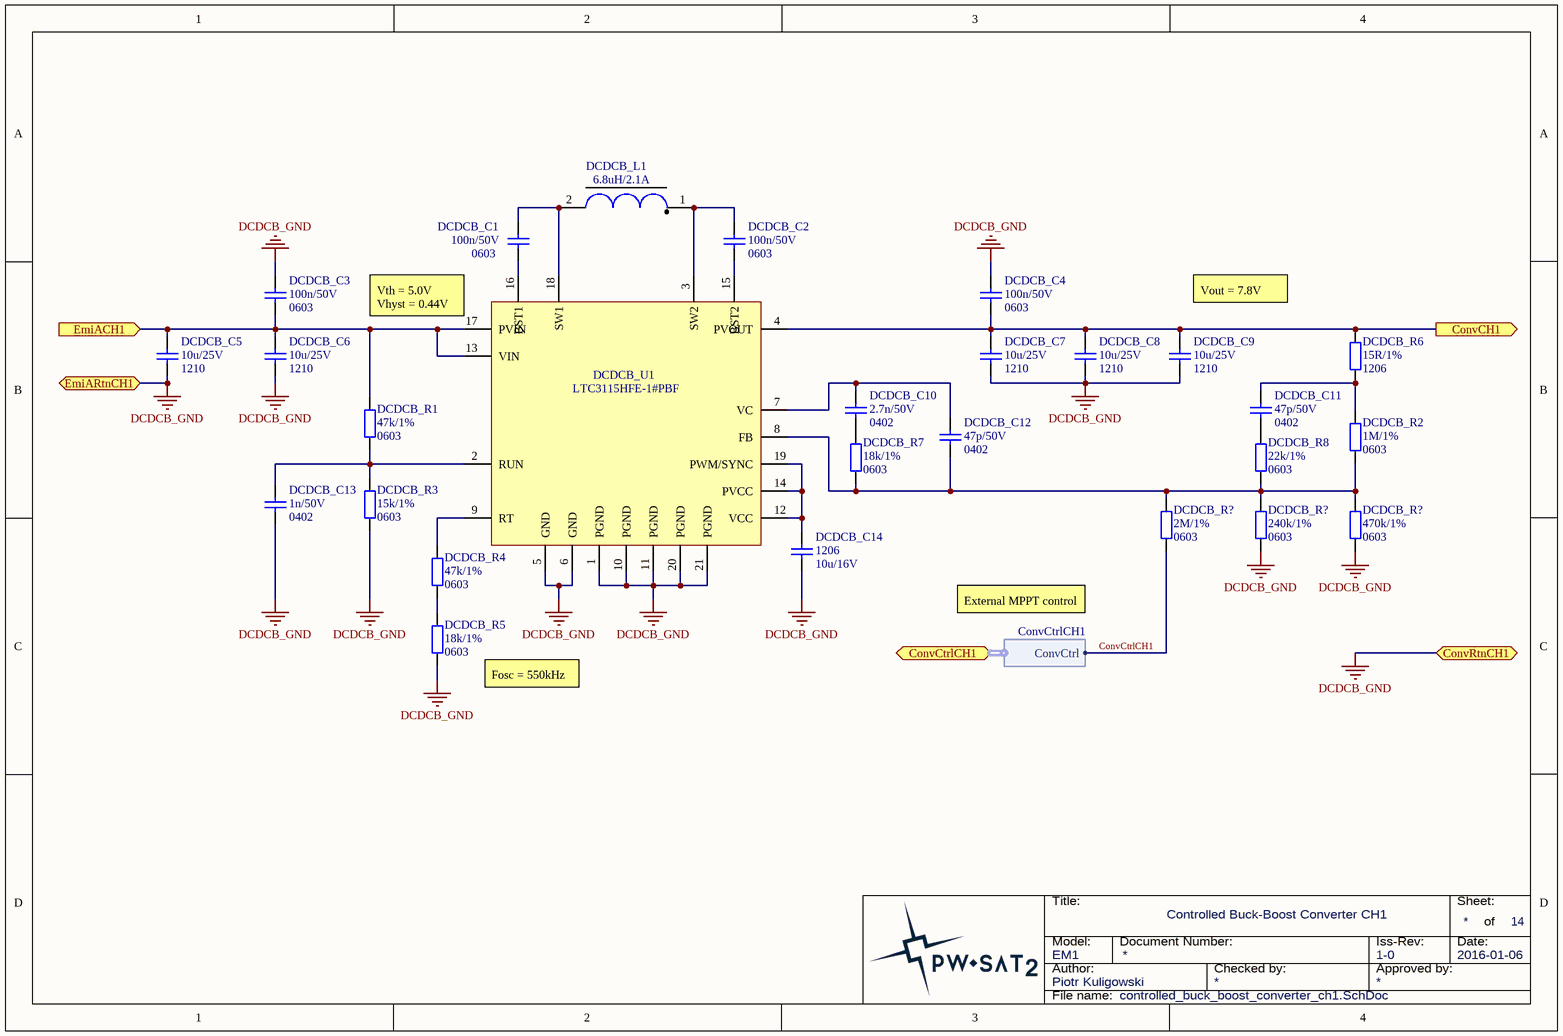
[diagram p7: controlled_buck_boost_converter_ch1.SchDoc]

### Parts
(Parts that share a designator on the sheet are numbered #1, #2 ... from top to bottom, then left to right.)
DCDCB_C1  Package: 0603  [SMD_Capacitor_0603]  (hidden comment: 100n/50V)
DCDCB_C2  Package: 0603  [SMD_Capacitor_0603]  (hidden comment: 100n/50V)
DCDCB_C3  Package: 0603  [SMD_Capacitor_0603]  (hidden comment: 100n/50V)
DCDCB_C4  Package: 0603  [SMD_Capacitor_0603]  (hidden comment: 100n/50V)
DCDCB_C5  Package: 1210  [SMD_Capacitor_1210]  (hidden comment: 10u/25V)
DCDCB_C6  Package: 1210  [SMD_Capacitor_1210]  (hidden comment: 10u/25V)
DCDCB_C7  Package: 1210  [SMD_Capacitor_1210]  (hidden comment: 10u/25V)
DCDCB_C8  Package: 1210  [SMD_Capacitor_1210]  (hidden comment: 10u/25V)
DCDCB_C9  Package: 1210  [SMD_Capacitor_1210]  (hidden comment: 10u/25V)
DCDCB_C10  Package: 0402  [SMD_Capacitor_0402]  (hidden comment: 2.7n/50V)
DCDCB_C11  Package: 0402  [SMD_Capacitor_0402]  (hidden comment: 47p/50V)
DCDCB_C12  Package: 0402  [SMD_Capacitor_0402]  (hidden comment: 47p/50V)
DCDCB_C13  Package: 0402  [SMD_Capacitor_0402]  (hidden comment: 1n/50V)
DCDCB_C14  Packge: 1206  [SMD_Capacitor_1206]  (hidden comment: 10u/16V)
DCDCB_L1  6.8uH/2.1A  [Coilcraft_MSS6132]
DCDCB_R1  Package: 0603  [SMD_Resistor_0603]  (hidden comment: 47k/1%)
DCDCB_R2  Package: 0603  [SMD_Resistor_0603]  (hidden comment: 1M/1%)
DCDCB_R3  Package: 0603  [SMD_Resistor_0603]  (hidden comment: 15k/1%)
DCDCB_R4  Package: 0603  [SMD_Resistor_0603]  (hidden comment: 47k/1%)
DCDCB_R5  Package: 0603  [SMD_Resistor_0603]  (hidden comment: 18k/1%)
DCDCB_R6  Package: 1206  [SMD_Resistor_1206]  (hidden comment: 15R/1%)
DCDCB_R7  Package: 0603  [SMD_Resistor_0603]  (hidden comment: 18k/1%)
DCDCB_R8  Package: 0603  [SMD_Resistor_0603]  (hidden comment: 22k/1%)
DCDCB_R?#1  Package: 0603  [SMD_Resistor_0603]  (hidden comment: 2M/1%)
DCDCB_R?#2  Package: 0603  [SMD_Resistor_0603]  (hidden comment: 240k/1%)
DCDCB_R?#3  Package: 0603  [SMD_Resistor_0603]  (hidden comment: 470k/1%)
DCDCB_U1  LTC3115HFE-1#PBF  [LT-FE-20-EPV-CA_N]

### Ports
ConvCH1 (out), ConvCtrlCH1 (harness ConvCtrlCH1), ConvRtnCH1, EmiACH1 (in), EmiARtnCH1

### Harnesses
ConvCtrlCH1: ConvCtrl

### Nets
DCDCB_GND: DCDCB_C3.1 DCDCB_C4.1 DCDCB_C5.2 DCDCB_C6.2 DCDCB_C7.2 DCDCB_C8.2 DCDCB_C9.2 DCDCB_C13.2 DCDCB_C14.2 DCDCB_R3.2 DCDCB_R5.2 DCDCB_R?#2.2 DCDCB_R?#3.2 DCDCB_U1.1(PGND) DCDCB_U1.5(GND) DCDCB_U1.6(GND) DCDCB_U1.10(PGND) DCDCB_U1.11(PGND) DCDCB_U1.20(PGND) DCDCB_U1.21(PGND) ; port EmiARtnCH1, port ConvRtnCH1
ConvCtrlCH1: DCDCB_R?#1.1 ; port ConvCtrlCH1.ConvCtrl
NetDCDCB_C1_1: DCDCB_C1.1 DCDCB_L1.2 DCDCB_U1.18(SW1)
NetDCDCB_C1_2: DCDCB_C1.2 DCDCB_U1.16(BST1)
NetDCDCB_C2_1: DCDCB_C2.1 DCDCB_L1.1 DCDCB_U1.3(SW2)
NetDCDCB_C2_2: DCDCB_C2.2 DCDCB_U1.15(BST2)
NetDCDCB_C3_2: DCDCB_C3.2 DCDCB_C5.1 DCDCB_C6.1 DCDCB_R1.1 DCDCB_U1.13(VIN) DCDCB_U1.17(PVIN) ; port EmiACH1
NetDCDCB_C4_2: DCDCB_C4.2 DCDCB_C7.1 DCDCB_C8.1 DCDCB_C9.1 DCDCB_R6.1 DCDCB_U1.4(PVOUT) ; port ConvCH1
NetDCDCB_C10_1: DCDCB_C10.1 DCDCB_C12.1 DCDCB_U1.7(VC)
NetDCDCB_C10_2: DCDCB_C10.2 DCDCB_R7.1
NetDCDCB_C11_1: DCDCB_C11.1 DCDCB_R2.1 DCDCB_R6.2
NetDCDCB_C11_2: DCDCB_C11.2 DCDCB_R8.1
NetDCDCB_C12_2: DCDCB_C12.2 DCDCB_R2.2 DCDCB_R7.2 DCDCB_R8.2 DCDCB_R?#1.2 DCDCB_R?#2.1 DCDCB_R?#3.1 DCDCB_U1.8(FB)
NetDCDCB_C13_1: DCDCB_C13.1 DCDCB_R1.2 DCDCB_R3.1 DCDCB_U1.2(RUN)
NetDCDCB_C14_1: DCDCB_C14.1 DCDCB_U1.12(VCC) DCDCB_U1.14(PVCC) DCDCB_U1.19(PWM/SYNC)
NetDCDCB_R4_1: DCDCB_R4.1 DCDCB_U1.9(RT)
NetDCDCB_R4_2: DCDCB_R4.2 DCDCB_R5.1

### Notes on the sheet
- (near DCDCB_U1) Vth = 5.0V
  Vhyst = 0.44V
- (near DCDCB_C9) Vout = 7.8V
- External MPPT control
- (near DCDCB_R5) Fosc = 550kHz
- Title:
- Sheet:
- of
- Author:
- Model:
- Document Number:
- Checked by:
- Iss-Rev:
- Approved by:
- Date:
- File name:

### Library data of the parts
DCDCB_C1-DCDCB_C4 = Cer_C0603T104K5RALTU: Ceramic Cap Kemet COTS 100n/50V X7R 0603; Manufacturer: Kemet; ManufacturerPartNumber: C0603T104K5RALTU; Value: 100n/50V
DCDCB_C5-DCDCB_C9 = Cer_GCJ32ER71E106KA12L: as EMIBB_C3 on sheet emi_filter_ch1_b; Manufacturer: Murata; ManufacturerPartNumber: GCJ32ER71E106KA12L; Value: 10u/25V
DCDCB_C10 = Cer_GCM2165C1H272JA16D: Ceramic Cap Murata Automotive 2.7n/50V C0G 0402; Manufacturer: Murata; ManufacturerPartNumber: GCM2165C1H272JA16D; Value: 2.7n/50V
DCDCB_C11 DCDCB_C12 = Cer_GCM1555C1H470JA16D: Ceramic Cap Murata Automotive 47p/50V C0G 0402; Manufacturer: Murata; ManufacturerPartNumber: GCM1555C1H470JA16D; Value: 47p/50V
DCDCB_C13 = Cer_GCM155R71H102KA37D: Ceramic Cap Murata Automotive 1n/50V X7R 0402; Manufacturer: Murata; ManufacturerPartNumber: GCM155R71H102KA37D; Value: 1n/50V
DCDCB_C14 = Cer_C1206T106K4RACTU: Ceramic Cap Kemet COTS 10u/16V X7R 1206; ManufacturerPartNumber: C1206T106K4RACTU; Manufacturer: Kemet; Value: 10u/16V
DCDCB_L1 = MSS6132-682MLx: Coilcraft MSS6132 Inductor, L=6.8uH, Irise20deg=2.1A, ESR=52mR, SRF=47MHz.; Manufacturer: Coilcraft; ManufacturerPartNumber: MSS6132-682MLx; Value: 6.8uH/2.1A
DCDCB_R1 DCDCB_R4 = CRCW060347K0FKxxxx: 47k/1% Vishay CRCW 0603 Resistor. 100mW, 100ppm, 75V.; Manufacturer: Vishay; ManufacturerPartNumber: CRCW060347K0FKxxxx; Value: 47k/1%
DCDCB_R2 = CRCW06031M00FKxxxx: 1M/1% Vishay CRCW 0603 Resistor. 100mW, 200ppm, 75V.; ManufacturerPartNumber: CRCW06031M00FKxxxx; Manufacturer: Vishay; Value: 1M/1%
DCDCB_R3 = CRCW060315K0FKxxxx: 15k/1% Vishay CRCW 0603 Resistor. 100mW, 200ppm, 75V.; ManufacturerPartNumber: CRCW060315K0FKxxxx; Manufacturer: Vishay; Value: 15k/1%
DCDCB_R5 DCDCB_R7 = CRCW060318K0FKxxxx: 18k/1% Vishay CRCW 0603 Resistor. 100mW, 200ppm, 75V.; ManufacturerPartNumber: CRCW060318K0FKxxxx; Manufacturer: Vishay; Value: 18k/1%
DCDCB_R6 = CRCW120615R0FKxxxx: 15R/1% Vishay CRCW 1206 Resistor. 250mW, 100ppm, 200V.; ManufacturerPartNumber: CRCW120615R0FKxxxx; Manufacturer: Vishay; Value: 15R/1%
DCDCB_R8 = CRCW060322K0FKxxxx: 22k/1% Vishay CRCW 0603 Resistor. 100mW, 200ppm, 75V.; ManufacturerPartNumber: CRCW060322K0FKxxxx; Manufacturer: Vishay; Value: 22k/1%
DCDCB_R?#1 = CRCW06032M00FKxxxx: 2M/1% Vishay CRCW 0603 Resistor. 100mW, 200ppm, 75V.; ManufacturerPartNumber: CRCW06032M00FKxxxx; Manufacturer: Vishay; Value: 2M/1%
DCDCB_R?#2 = CRCW0603240KFKxxxx: 240k/1% Vishay CRCW 0603 Resistor. 100mW, 200ppm, 75V.; Manufacturer: Vishay; ManufacturerPartNumber: CRCW0603240KFKxxxx; Value: 240k/1%
DCDCB_R?#3 = CRCW0603470KFKxxxx: 470k/1% Vishay CRCW 0603 Resistor. 100mW, 100ppm, 75V.; Manufacturer: Vishay; ManufacturerPartNumber: CRCW0603470KFKxxxx; Value: 470k/1%
DCDCB_U1 = LTC3115HFE-1#PBF: 40V, 2A Synchronous Buck-Boost DC/DC Converter, 20-pin SOP (FE-20-EPV-CA), -40 to 150 degC, Pb-Free; Manufacturer: Linear Technology; Package: FE-20-EPV-CA; Value: LTC3115HFE-1#PBF

## Nets that join several sheets
DCDCB_GND: top_power (MPPT_H1.1 MPPT_H1.2), cm_filter_ch1_a (CMBA_C2.2 CMBA_T1.3), mppt_interface_ch1 (14 pins), measurement_ch1 (12 pins), emi_filter_ch1_a (EMIBA_C1.2 EMIBA_C2.2), emi_filter_ch1_b (EMIBB_C1.2 EMIBB_C2.2 EMIBB_C3.2), cm_filter_ch1_b (CMBB_C2.2 CMBB_T1.2), controlled_buck_boost_converter_ch1 (20 pins)
MeasCH1_3V0: top_power (MPPT_H1.8), mppt_interface_ch1 (10 pins), measurement_ch1 (5 pins)
PE: cm_filter_ch1_a (CMBA_C1.2 CMBA_C2.1), cm_filter_ch1_b (CMBB_C1.2 CMBB_C2.1)
ConvCtrlCH1: mppt_interface_ch1 (MPPTB_U1.1), controlled_buck_boost_converter_ch1 (DCDCB_R?#1.1)
MeasCH1_I: mppt_interface_ch1 (MPPTB_R2.1), measurement_ch1 (MB_U2.2)
MeasCH1_V: mppt_interface_ch1 (MPPTB_C4.1 MPPTB_U2.6), measurement_ch1 (MB_R2.2 MB_R3.1)
MPPTB_CS_ADC: top_power (MPPT_H1.4), mppt_interface_ch1 (MPPTB_U2.1)
MPPTB_CS_DAC: top_power (MPPT_H1.6), mppt_interface_ch1 (MPPTB_U1.6)
MPPTB_DIN: top_power (MPPT_H1.7), mppt_interface_ch1 (MPPTB_U1.4 MPPTB_U2.8)
MPPTB_DOUT: top_power (MPPT_H1.5), mppt_interface_ch1 (MPPTB_U2.9)
MPPTB_SCLK: top_power (MPPT_H1.3), mppt_interface_ch1 (MPPTB_R1.1 MPPTB_U1.5 MPPTB_U2.10)
NetCMBA_C1_1: cm_filter_ch1_a (CMBA_C1.1 CMBA_T1.4), measurement_ch1 (MB_R1.1 MB_R2.1 MB_R4.1)
NetCMBA_T1_1: top_power (IN_K1.2), cm_filter_ch1_a (CMBA_T1.1)
NetCMBA_T1_2: top_power (IN_K1.1), cm_filter_ch1_a (CMBA_T1.2)
NetCMBB_C1_1: mppt_interface_ch1 (MPPTB_R4.1), emi_filter_ch1_b (EMIBB_C1.1 EMIBB_C2.1 EMIBB_FB1.1 EMIBB_R1.2), cm_filter_ch1_b (CMBB_C1.1 CMBB_T1.1)
NetCMBB_T1_3: top_power (OUT_K1.1), cm_filter_ch1_b (CMBB_T1.3)
NetCMBB_T1_4: top_power (OUT_K1.2), cm_filter_ch1_b (CMBB_T1.4)
NetDCDCB_C3_2: emi_filter_ch1_a (EMIBA_L1.1 EMIBA_L2.1 EMIBA_R2.2), controlled_buck_boost_converter_ch1 (6 pins)
NetDCDCB_C4_2: emi_filter_ch1_b (EMIBB_FB1.2), controlled_buck_boost_converter_ch1 (6 pins)
NetEMIBA_C1_1: measurement_ch1 (MB_R1.4), emi_filter_ch1_a (EMIBA_C1.1 EMIBA_L2.2 EMIBA_R1.1)